# EAGLE schematic Rover (EAGLE 9.2.2)
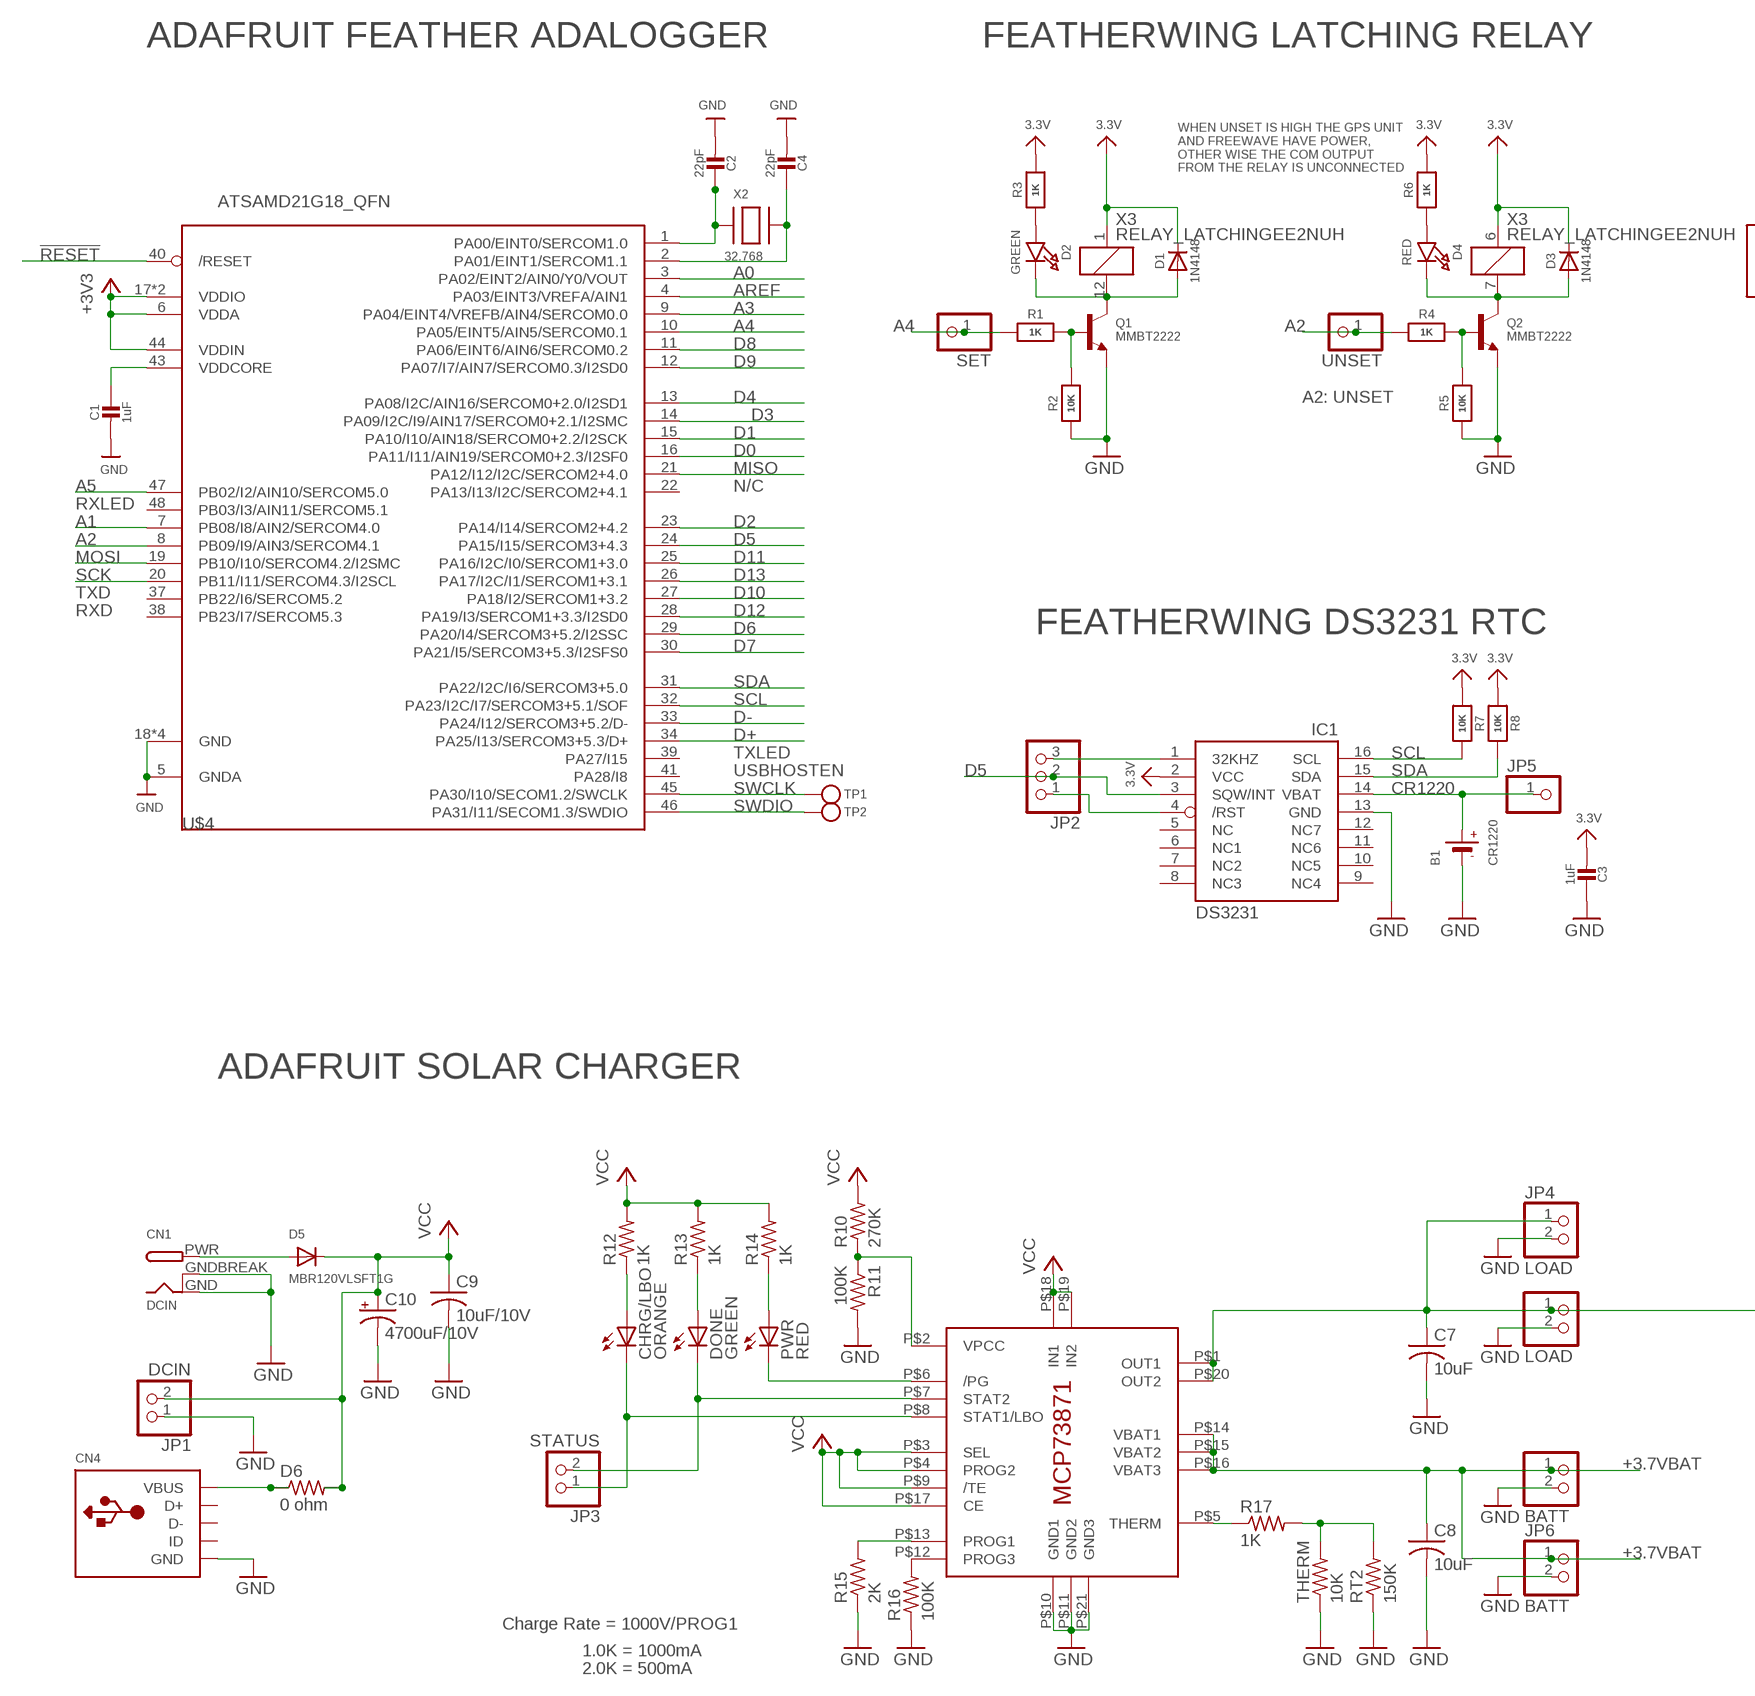
[diagram p0: schematic, sheet 1, part 1 of 2]
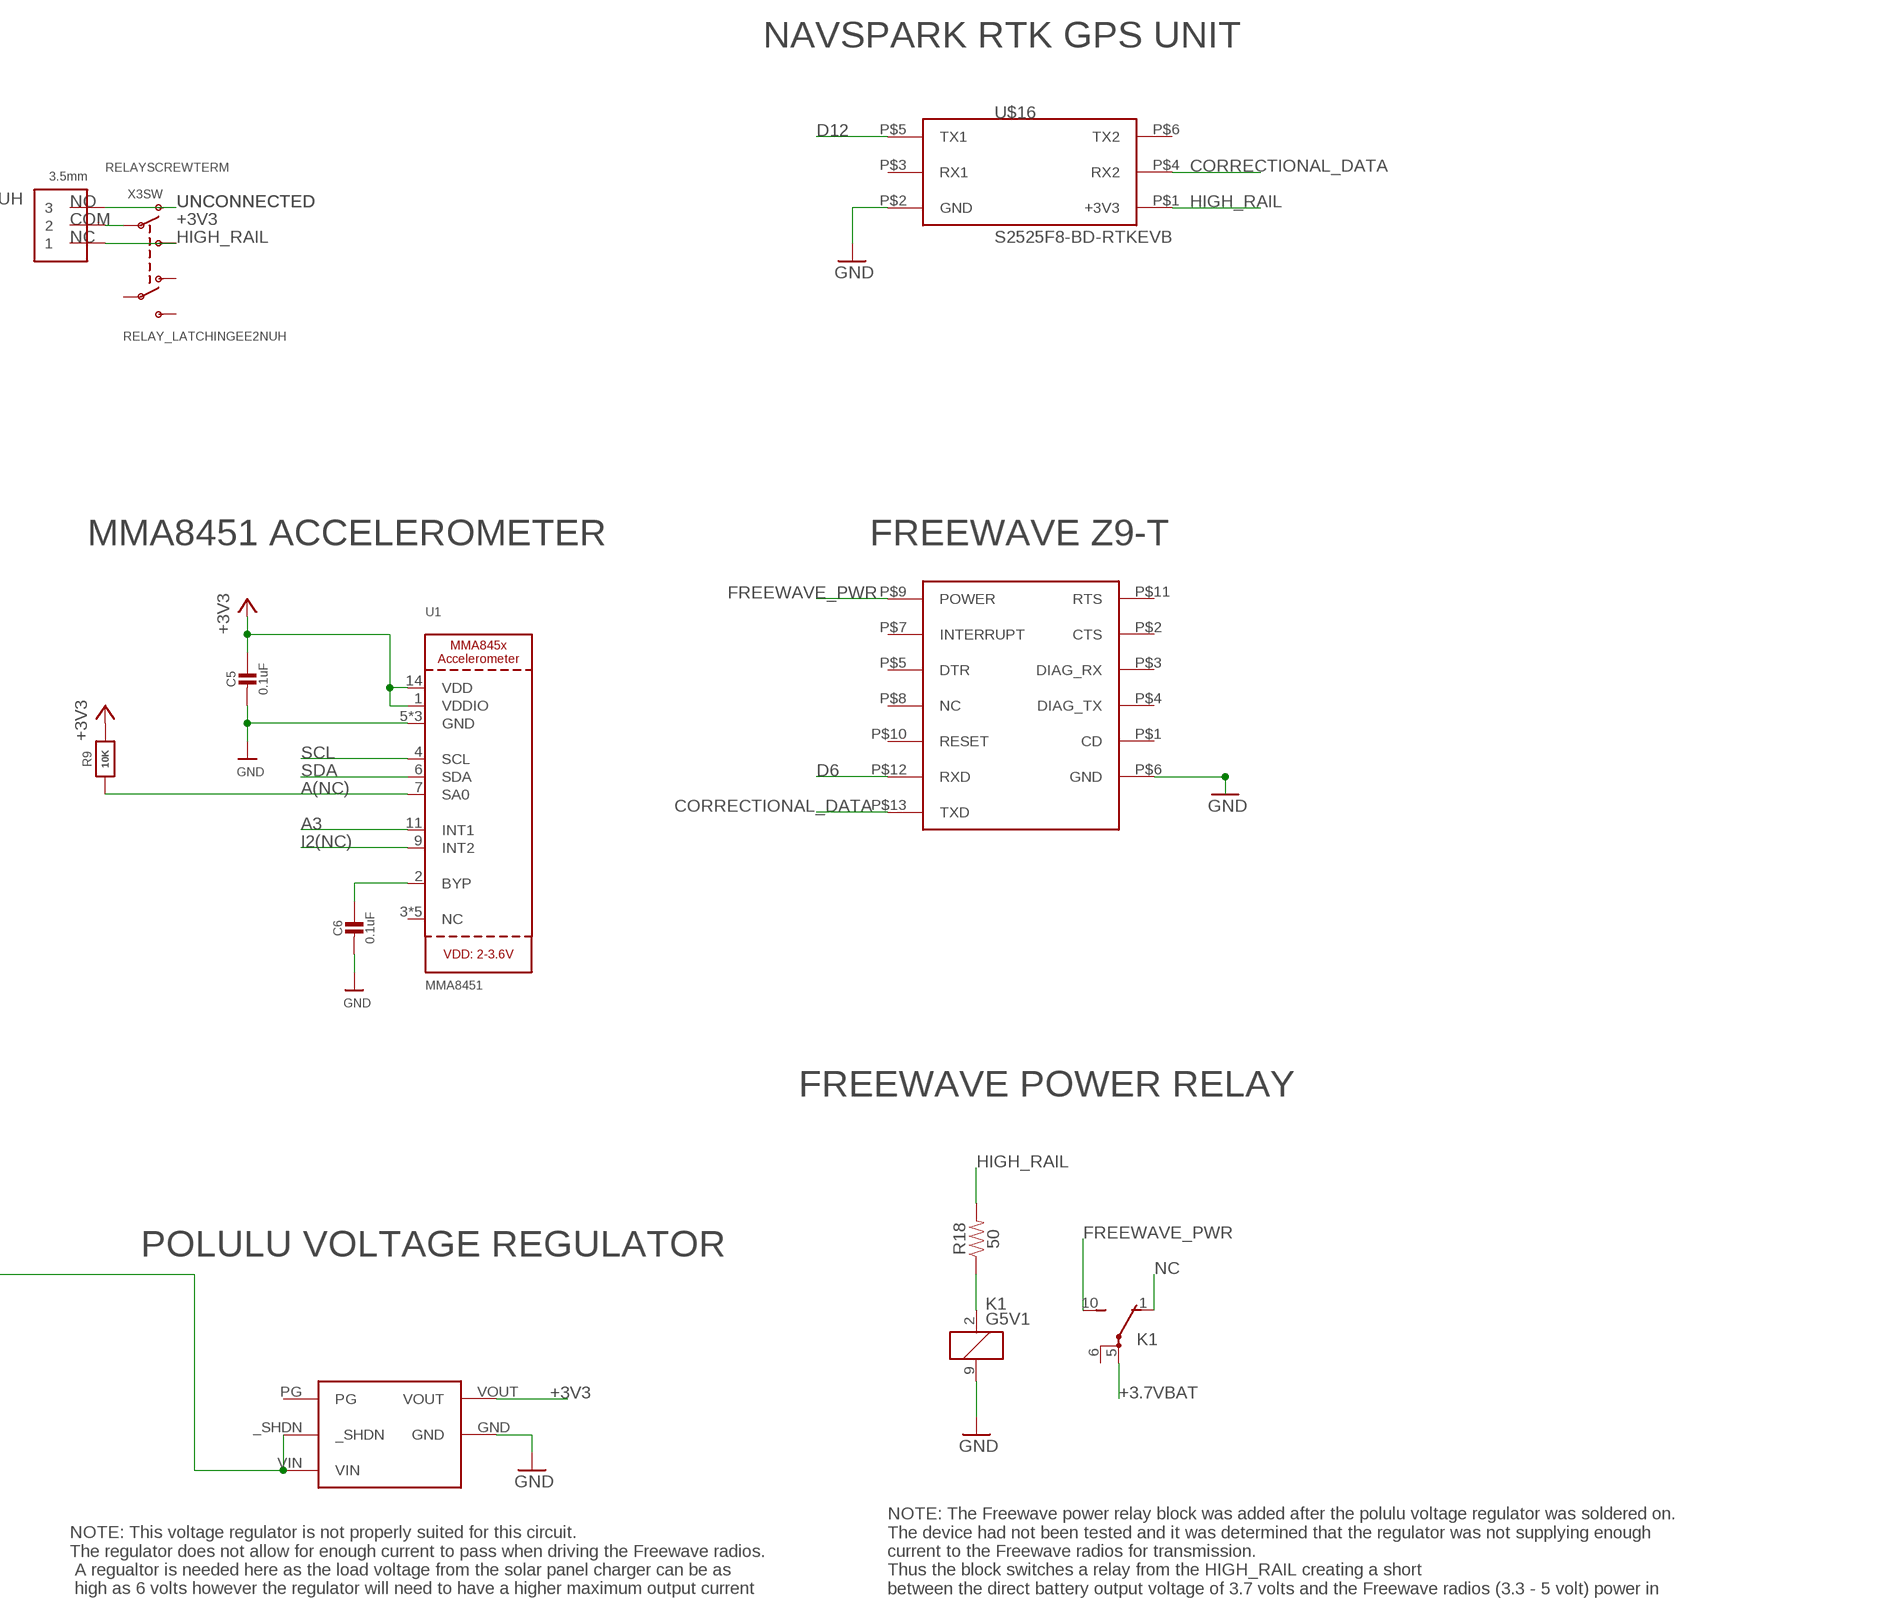
[diagram p1: schematic, sheet 1, part 2 of 2]

## Parts
B1  CR1220  BATTERYCR1220_2  [CR1220-2]
BATT  JST_2PIN-SMT-RA  [JST-PH-2-SMT-RA]
C1  1uF  CAP_CERAMIC0603_NO  [0603-NO]
C2  22pF  CAP_CERAMIC0603_NO  [0603-NO]
C3  1uF  CAP_CERAMIC0805-NOOUTLINE  [0805-NO]
C4  22pF  CAP_CERAMIC0603_NO  [0603-NO]
C5  0.1uF  CAP_CERAMIC0805-NOOUTLINE  [0805-NO]
C6  0.1uF  CAP_CERAMIC0805_10MGAP  [0805_10MGAP]
C7  10uF  C-USC0805K  [C0805K]
C8  10uF  C-USC0805K  [C0805K]
C9  10uF/10V  C-USC0805K  [C0805K]
C10  4700uF/10V  CPOL-USE5-13  [E5-13]
CHRG/LBO  ORANGE  LEDCHIP-LED0805  [CHIP-LED0805]
CN1  DCIN  DCBARREL1.3MM  [DCJACK_1.3MM_PTH]
CN4  USBMINIB  [USB-MINIB]
D1  1N4148  DIODESOD-323  [SOD-323]
D2  GREEN  LED0805_NOOUTLINE  [CHIPLED_0805_NOOUTLINE]
D3  1N4148  DIODESOD-323  [SOD-323]
D4  RED  LED0805_NOOUTLINE  [CHIPLED_0805_NOOUTLINE]
D5  MBR120VLSFT1G  DIODESOD-123  [SOD-123]
D6  0 ohm  R-US_R0805  [R0805]
DONE  GREEN  LEDCHIP-LED0805  [CHIP-LED0805]
IC1  DS3231/SO  [SO16W]
IC2  MCP73871  [QFN20_4MM]
JP1  DCIN  HEADER-1X2  [1X02_OVAL]
JP2  HEADER-1X3ROUND  [1X03_ROUND]
JP3  STATUS  HEADER-1X2  [1X02_OVAL]
JP4  LOAD  HEADER-1X2  [1X02_OVAL]
JP5  HEADER-1X1ROUND  [1X01_ROUND]
JP6  BATT  HEADER-1X2  [1X02_OVAL]
K1  G5V1  [G5V1]
LOAD  JST_2PIN-SMT-RA  [JST-PH-2-SMT-RA]
PWR  RED  LEDCHIP-LED0805  [CHIP-LED0805]
Q1  MMBT2222  TRANSISTOR_NPN  [SOT23-R@1]
Q2  MMBT2222  TRANSISTOR_NPN  [SOT23-R@1]
R1  1K  RESISTOR0805_NOOUTLINE  [0805-NO]
R2  10K  RESISTOR0805_NOOUTLINE  [0805-NO]
R3  1K  RESISTOR0805_NOOUTLINE  [0805-NO]
R4  1K  RESISTOR0805_NOOUTLINE  [0805-NO]
R5  10K  RESISTOR0805_NOOUTLINE  [0805-NO]
R6  1K  RESISTOR0805_NOOUTLINE  [0805-NO]
R7  10K  RESISTOR0805_NOOUTLINE  [0805-NO]
R8  10K  RESISTOR0805_NOOUTLINE  [0805-NO]
R9  10K  RESISTOR0805_NOOUTLINE  [0805-NO]
R10  270K  R-US_R0805  [R0805]
R11  100K  R-US_R0805  [R0805]
R12  1K  R-US_R0805  [R0805]
R13  1K  R-US_R0805  [R0805]
R14  1K  R-US_R0805  [R0805]
R15  2K  R-US_FLIPFLOP  [0805-THM]
R16  100K  R-US_R0805  [R0805]
R17  1K  R-US_M0805  [M0805]
R18  50  1.8KOHM-0603-1/10W-1%  [0603]
RELAYSCREWTERM  3.5mm  TERMBLOCK_1X3  [TERMBLOCK_1X3-3.5MM]
RT2  150K  R-US_M0805  [M0805]
SET  HEADER-1X1ROUND  [1X01_ROUND]
THERM  10K  R-US_FLIPFLOP  [0805-THM]
TP1  TESTPOINTROUND1.5MM  [TESTPOINT_ROUND_1.5MM]
TP2  TESTPOINTROUND1.5MM  [TESTPOINT_ROUND_1.5MM]
U1  MMA8451  ACCEL_MMA845X  [MMA845X_QFN_16MM]
U$4  ATSAMD21G18_QFN  ATSAMD21J_QFN  [TQFN48_7MM]
U$16  S2525F8-BD-RTKEVB  [S2525F8-BD-RTKEVB]
U$17  Z9-T  [Z9-T]
U$18  POLULU0J8557  [POLULU0J8557]
UNSET  HEADER-1X1ROUND  [1X01_ROUND]
X2  32.768  XTAL-3.2X1.5  [XTAL3215]
X3  RELAY_LATCHINGEE2NUH  [RELAY_EE2_LATCH]

## Nets
3.3V: C3.2 D1.C D3.C IC1.2(VCC) R3.2 R6.2 R7.1 R8.1 X3.1 X3.6
32KHZ: IC1.1(32KHZ) JP2.3
!RESET: U$4.40(/RESET)
!RTC_RST: IC1.4(/RST) JP2.1
+3.7VBAT: BATT.1 C8.1 IC2.P$14(VBAT1) IC2.P$15(VBAT2) IC2.P$16(VBAT3) JP6.1 K1.5(2:P)
+3V3: C5.1 R9.2 RELAYSCREWTERM.2 U1.1(VDDIO) U1.14(VDD) U$4.6(VDDA) U$4.17(VDDIO) U$4.36(VDDIO) U$4.44(VDDIN) U$18.VOUT X3.9(SW:P1)
A0: U$4.3(PA02/EINT2/AIN0/Y0/VOUT)
A1: U$4.7(PB08/I8/AIN2/SERCOM4.0)
A2: R4.1 U$4.8(PB09/I9/AIN3/SERCOM4.1) UNSET.1
A3: U1.11(INT1) U$4.9(PA04/EINT4/VREFB/AIN4/SERCOM0.0)
A4: R1.1 SET.1 U$4.10(PA05/EINT5/AIN5/SERCOM0.1)
A5: U$4.47(PB02/I2/AIN10/SERCOM5.0)
A(NC): R9.1 U1.7(SA0)
AREF: U$4.4(PA03/EINT3/VREFA/AIN1)
CORRECTIONAL_DATA: U$16.P$4(RX2) U$17.P$13(TXD)
CR1220: B1.+ IC1.14(VBAT) JP5.1
D0: U$4.16(PA11/I11/AIN19/SERCOM0+2.3/I2SF0)
D1: U$4.15(PA10/I10/AIN18/SERCOM0+2.2/I2SCK)
D2: U$4.23(PA14/I14/SERCOM2+4.2)
D3: U$4.14(PA09/I2C/I9/AIN17/SERCOM0+2.1/I2SMC)
D4: U$4.13(PA08/I2C/AIN16/SERCOM0+2.0/I2SD1)
D5: IC1.3(SQW/INT) JP2.2 U$4.24(PA15/I15/SERCOM3+4.3)
D6: U$4.29(PA20/I4/SERCOM3+5.2/I2SSC) U$17.P$12(RXD)
D7: U$4.30(PA21/I5/SERCOM3+5.3/I2SFS0)
D8: U$4.11(PA06/EINT6/AIN6/SERCOM0.2)
D9: U$4.12(PA07/I7/AIN7/SERCOM0.3/I2SD0)
D10: U$4.27(PA18/I2/SERCOM1+3.2)
D11: U$4.25(PA16/I2C/I0/SERCOM1+3.0)
D12: U$4.28(PA19/I3/SERCOM1+3.3/I2SD0) U$16.P$5(TX1)
D13: U$4.26(PA17/I2C/I1/SERCOM1+3.1)
D+: U$4.34(PA25/I13/SERCOM3+5.3/D+)
D-: U$4.33(PA24/I12/SERCOM3+5.2/D-)
FREEWAVE_PWR: K1.10(2:S) U$17.P$9(POWER)
GND: B1.- BATT.2 C1.2 C2.2 C3.1 C4.2 C5.2 C6.2 C7.2 C8.2 C9.2 C10.- CN1.GND CN1.GNDBREAK CN4.GND IC1.13(GND) IC2.P$10(GND1) IC2.P$11(GND2) IC2.P$21(GND3) JP1.1 JP4.2 JP6.2 K1.9 LOAD.2 Q1.2(E) Q2.2(E) R2.1 R5.1 R11.2 R15.1 R16.1 RT2.1 THERM.1 U1.5(GND) U1.10(GND) U1.12(GND) U$4.5(GNDA) U$4.18(GND) U$4.35(GND) U$4.42(GND) U$4.THERMAL(GND) U$16.P$2(GND) U$17.P$6(GND) U$18.GND
HIGH_RAIL: R18.2 RELAYSCREWTERM.1 U$16.P$1(+3V3) X3.8(SW:S1)
I2(NC): U1.9(INT2)
MISO: U$4.21(PA12/I12/I2C/SERCOM2+4.0)
MOSI: U$4.19(PB10/I10/SERCOM4.2/I2SMC)
N$1: C6.1 U1.2(BYP)
N$2: IC2.P$6(/PG) PWR.C
N$3: C7.1 IC2.P$1(OUT1) IC2.P$20(OUT2) JP4.1 LOAD.1 U$18._SHDN U$18.VIN
N$4: DONE.C IC2.P$7(STAT2) JP3.2
N$5: C2.1 U$4.1(PA00/EINT0/SERCOM1.0) X2.P$1
N$6: IC2.P$2(VPCC) R10.1 R11.1
N$7: C4.1 U$4.2(PA01/EINT1/SERCOM1.1) X2.P$2
N$8: IC2.P$5(THERM) R17.1
N$9: R17.2 RT2.2 THERM.2
N$10: CN1.PWR D5.A
N$11: CHRG/LBO.C IC2.P$8(STAT1/LBO) JP3.1
N$12: CHRG/LBO.A R12.1
N$13: DONE.A R13.1
N$14: PWR.A R14.1
N$15: IC2.P$12(PROG3) R16.2
N$16: IC2.P$13(PROG1) R15.2
N$17: CN4.VBUS D6.1
N$18: K1.2 R18.1
N$24: D1.A D2.C Q1.3(C) X3.12
N$25: Q1.1(B) R1.2 R2.2
N$27: D2.A R3.1
N$29: D3.A D4.C Q2.3(C) X3.7
N$30: Q2.1(B) R4.2 R5.2
N$32: D4.A R6.1
NC: K1.1(2:O)
SCK: U$4.20(PB11/I11/SERCOM4.3/I2SCL)
SCL: IC1.16(SCL) R7.2 U1.4(SCL) U$4.32(PA23/I2C/I7/SERCOM3+5.1/SOF)
SDA: IC1.15(SDA) R8.2 U1.6(SDA) U$4.31(PA22/I2C/I6/SERCOM3+5.0)
SWCLK: TP1.P$1 U$4.45(PA30/I10/SECOM1.2/SWCLK)
SWDIO: TP2.P$1 U$4.46(PA31/I11/SECOM1.3/SWDIO)
UNCONNECTED [HV]: RELAYSCREWTERM.3 X3.10(SW:O1)
VCC: C9.1 C10.+ D5.C D6.2 IC2.P$3(SEL) IC2.P$4(PROG2) IC2.P$9(/TE) IC2.P$17(CE) IC2.P$18(IN1) IC2.P$19(IN2) JP1.2 R10.2 R12.2 R13.2 R14.2
VDDCORE: C1.1 U$4.43(VDDCORE)
Unconnected: CN4.D+ CN4.D- CN4.ID IC1.5(NC) IC1.6(NC1) IC1.7(NC2) IC1.8(NC3) IC1.9(NC4) IC1.10(NC5) IC1.11(NC6) IC1.12(NC7) K1.6(2:P) U1.3(NC) U1.8(NC) U1.13(NC) U1.15(NC) U1.16(NC) U$4.22(PA13/I13/I2C/SERCOM2+4.1) U$4.37(PB22/I6/SERCOM5.2) U$4.38(PB23/I7/SERCOM5.3) U$4.39(PA27/I15) U$4.41(PA28/I8) U$4.48(PB03/I3/AIN11/SERCOM5.1) U$16.P$3(RX1) U$16.P$6(TX2) U$17.P$1(CD) U$17.P$2(CTS) U$17.P$3(DIAG_RX) U$17.P$4(DIAG_TX) U$17.P$5(DTR) U$17.P$7(INTERRUPT) U$17.P$8(NC) U$17.P$10(RESET) U$17.P$11(RTS) U$18.PG X3.3(SW:O2) X3.4(SW:P2) X3.5(SW:S2)

## Notes on the sheet
- ADAFRUIT FEATHER ADALOGGER | FEATHERWING LATCHING RELAY
- NAVSPARK RTK GPS UNIT
- WHEN UNSET IS HIGH THE GPS UNIT
  AND FREEWAVE HAVE POWER, 
  OTHER WISE THE COM OUTPUT 
  FROM THE RELAY IS UNCONNECTED
- NO
- COM
- NC
- A2: UNSET
- N/C
- RXLED
- MMA8451 ACCELEROMETER | FREEWAVE Z9-T
- TXD
- RXD
- FEATHERWING DS3231 RTC
- TXLED
- USBHOSTEN
- ADAFRUIT SOLAR CHARGER
- FREEWAVE POWER RELAY
- POLULU VOLTAGE REGULATOR
- Charge Rate = 1000V/PROG1
- NOTE: This voltage regulator is not properly suited for this circuit. 
  The regulator does not allow for enough current to pass when driving the Freewave radios.
   A regualtor is needed here as the load voltage from the solar panel charger can be as
   high as 6 volts however the regulator will need to have a higher maximum output current
- NOTE: The Freewave power relay block was added after the polulu voltage regulator was soldered on. 
  The device had not been tested and it was determined that the regulator was not supplying enough 
  current to the Freewave radios for transmission. 
  Thus the block switches a relay from the HIGH_RAIL creating a short 
  between the direct battery output voltage of 3.7 volts and the Freewave radios (3.3 - 5 volt) power in
- 1.0K = 1000mA
- 2.0K = 500mA

## Library data of the parts
B1 = microbuilder:BATTERY: CR1220 SMT - Digikey: 3001K-ND CD2032 BAT-HLD-001 - Digikey: BAT-HLD-001-ND
BATT LOAD = adafruit:JST_2PIN: JST 2-Pin Connectors of various flavors SMT-RA (S2B-PH-SM4) 4UConnector #17311 SMT (B2B-PH-SM4) THM-RA (S2B-PH) THM (B2B-PH)
C1-C6 = microbuilder:CAP_CERAMIC: Ceramic Capacitors For new designs, use the packages preceded by an '_' character since they are more reliable: The following footprints should be used on most boards: _0402 - Standard footprint for regular board layouts _0603 - Standard footprint for regular board layouts _0805 - Standard footprint for regular board layouts _1206 - Standard footprint for regular board layouts For extremely tight-pitch boards where space is at a premium, the following 'micro-pitch' footprints can be used (smaller pads, no silkscreen outline, etc.): _0402MP - Micro-pitch footprint for very dense/compact boards _0603MP - Micro-pitch footprint for very dense/compact boards _0805MP - Micro-pitch footprint for very dense/compact boards _1206MP - Micro-pitch footprint for very dense/compact boards
C7-C9 = adafruit:C-US: CAPACITOR, American symbol
C10 = adafruit:CPOL-US: POLARIZED CAPACITOR, American symbol
CHRG/LBO DONE PWR = adafruit:LED: LED
CN1 = microbuilder:DCBARREL: DC Barrel Jack DCJACK_1.3MM_PTH - Through Hole 1.3mm Jack (4UConnector: 05536) DCJACK_2MM_PTH - Through Hole 2.0/2.1 Jack (4UConnector: 05537) DCJACK_2MM_SMT - SMT 2.0/2.1mm Jack(4UConnector: 03267)
CN4 = adafruit:USB: USB Connectors USBMINIB - Surface Mount Female Mini-B USB Connector 4UConnector: 06564 By microbuilder.eu Thru-hole RA Female Mini-B USB Connector 4UConnector: 18732 By ladyada.net
D1 D3 D5 = microbuilder:DIODE: Diode SMADIODE - SMA Surface Mount Package 20V 1A Schottky Diode Digikey (500mV @ 1A, 500uA Vr @ 20V): 641-1014-6-ND SOD-123 30V 500mA (430mV Vf, 130uA Vr @ 30V) Schottky Diode - Digikey: B0530W-FDICT-ND SOD-323 10V 570mA (380mV Vf, 3ns) Schottky Diode - Digikey: ZLLS410CT-ND 1N4148WS - 75V 150mA (1V Vf @ 10mA, 4ns) Simple Diode - Digikey: 1N4148WSFSCT-ND, Mouser: 512-1N4148WS SOD-523 30V 30mA Schottky Diode (RB751S-40TE61) - Digikey: RB751S-40TE61CT-ND SOT23-R/W - SOT23 Package (R = Solder Paste/Reflow Ovens, W = Hand-Soldering) BAT54Film 40V 300mA - Digikey: 497-7162-1-ND DO-1N4148 Through Hole Small Current Diode (any model)
D2 D4 = microbuilder:LED: LED
D6 R10-R17 RT2 THERM = adafruit:R-US_: RESISTOR, American symbol
IC1 = adafruit:DS3231
IC2 = adafruit:MCP73871
JP1 JP3 JP4 JP6 = microbuilder:HEADER-1X2: PIN HEADER
JP2 = microbuilder:HEADER-1X3: PIN HEADER
JP5 SET UNSET = microbuilder:HEADER-1X1: PIN HEADER
K1 = relay:G5V1: RELAY 1 x switch, 0.5 A/125 V AC, 1 A/24 V DC , Omron; MPN: G5V-1-DC24; OC_FARNELL: 9949593; OC_NEWARK: 36M6377
Q1 Q2 = microbuilder:TRANSISTOR_NPN: NPN Transistor Transistor (NPN) 500mA 45V - BC817 [Digikey: 568-1631-1-ND] Transistor (NPN) 500mA 45V - BC817,215 [Mouser: 771-BC817-T/R] SOT23-R - SOT23 footprint optimised for use with solder paste and reflow ovens. SOT23-W - SOT23 footprint optimised for hand-soldering (larger pads).
R1-R9 = microbuilder:RESISTOR: Resistors For new designs, use the packages preceded by an '_' character since they are more reliable: The following footprints should be used on most boards: _0402 - Standard footprint for regular board layouts _0603 - Standard footprint for regular board layouts _0805 - Standard footprint for regular board layouts _1206 - Standard footprint for regular board layouts For extremely tight-pitch boards where space is at a premium, the following 'micro-pitch' footprints can be used (smaller pads, no silkscreen outline, etc.): _0402MP - Micro-pitch footprint for very dense/compact boards _0603MP - Micro-pitch footprint for very dense/compact boards _0805MP - Micro-pitch footprint for very dense/compact boards _1206MP - Micro-pitch footprint for very dense/compact boards
R18 = SparkFun-Resistors:1.8KOHM: 1.8kΩ resistor A resistor is a passive two-terminal electrical component that implements electrical resistance as a circuit element. Resistors act to reduce current flow, and, at the same time, act to lower voltage levels within circuits. - Wikipedia; PROD_ID: RES-09119; VALUE: 1.8k
RELAYSCREWTERM = microbuilder:TERMBLOCK_1X3: 3.5mm Terminal block http://www.ladyada.net/library/pcb/eaglelibrary.html
TP1 TP2 = microbuilder:TESTPOINT: Test Point Various test points for characterisation and PCB testing TESTPOINT_SMT - Compact Surface Mount Test Point [Digikey: 5016KTR-ND]
U1 = microbuilder:ACCEL_MMA845X: MMA845x 3-Axis ±2g/±4g/±8g Accelerometer
U$4 = microbuilder:ATSAMD21J
U$16 = NAVSPARKGPS:S2525F8-BD-RTKEVB
U$17 = SlideSentinel:Z9-T
U$18 = SlideSentinel:POLULU0J8557
X2 = adafruit2:XTAL: Low cost SMT crystals, no capacitors included http://www.ladyada.net/library/eagle
X3 = microbuilder:RELAY_LATCHING

## Net classes
1 HV: width 0.406 mm, drill 0.381 mm, clearance 1.016 mm